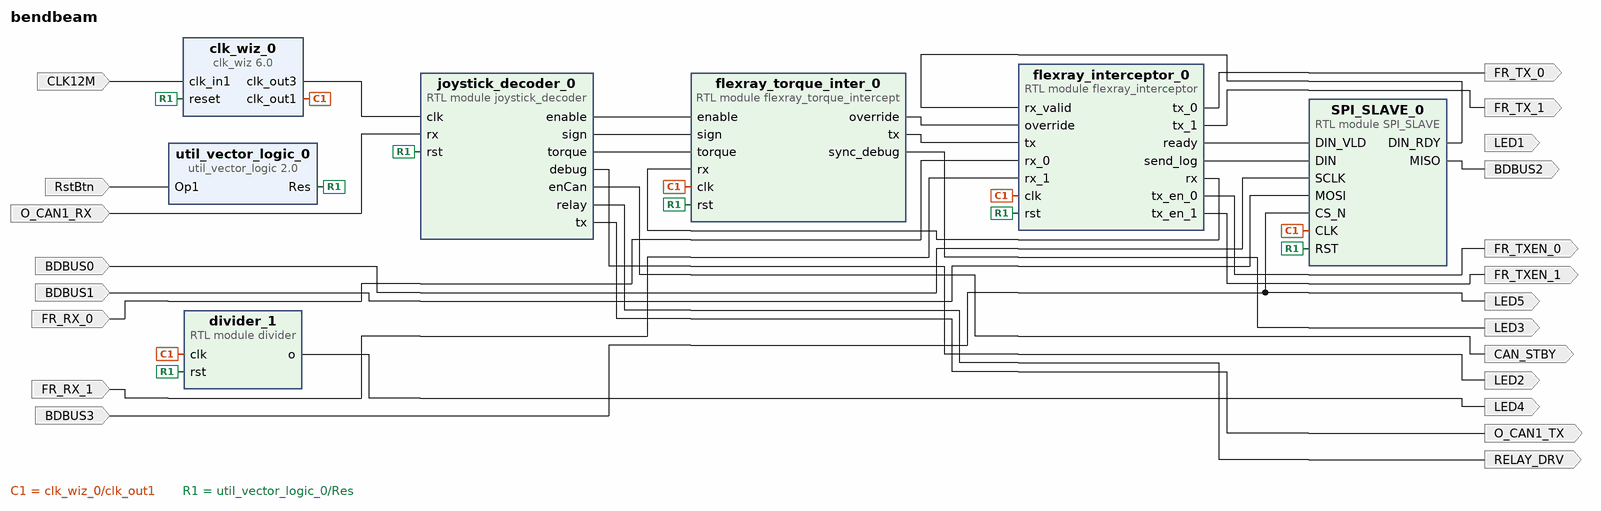
[diagram p0: block diagram of the top level]
# Vivado block design bendbeam, xa7s50csga324-1Q, Vivado 2024.2
create_bd_design bendbeam

create_bd_port -dir I -type clk CLK12M
set_property -dict {CONFIG.FREQ_HZ 12000000} [get_bd_ports CLK12M]
create_bd_port -dir I -type rst RstBtn
create_bd_port -dir I -type data BDBUS3
create_bd_port -dir I -type data FR_RX_0
create_bd_port -dir I -type data FR_RX_1
create_bd_port -dir O -type data RELAY_DRV
create_bd_port -dir O -type data FR_TX_0
create_bd_port -dir O -type data FR_TX_1
create_bd_port -dir O -type data FR_TXEN_0
create_bd_port -dir O -type data FR_TXEN_1
create_bd_port -dir O -type data O_CAN1_TX
create_bd_port -dir I -type data O_CAN1_RX
create_bd_port -dir O -type data CAN_STBY
create_bd_port -dir O LED4
create_bd_port -dir O BDBUS2
create_bd_port -dir I BDBUS1
create_bd_port -dir I BDBUS0
create_bd_port -dir O LED5
create_bd_port -dir O LED3
create_bd_port -dir O LED2
create_bd_port -dir O LED1

create_bd_cell -type ip -vlnv xilinx.com:ip:clk_wiz:6.0 clk_wiz_0
set_property -dict [list \
  CONFIG.CLKIN1_JITTER_PS 833.33 \
  CONFIG.CLKOUT1_JITTER 588.050 \
  CONFIG.CLKOUT1_PHASE_ERROR 613.025 \
  CONFIG.CLKOUT1_REQUESTED_OUT_FREQ 80.000 \
  CONFIG.CLKOUT2_JITTER 686.725 \
  CONFIG.CLKOUT2_PHASE_ERROR 613.025 \
  CONFIG.CLKOUT2_REQUESTED_OUT_FREQ 40.000 \
  CONFIG.CLKOUT2_USED true \
  CONFIG.CLKOUT3_JITTER 959.347 \
  CONFIG.CLKOUT3_PHASE_ERROR 613.025 \
  CONFIG.CLKOUT3_REQUESTED_OUT_FREQ 6.400 \
  CONFIG.CLKOUT3_USED true \
  CONFIG.MMCM_CLKFBOUT_MULT_F 50.000 \
  CONFIG.MMCM_CLKIN1_PERIOD 83.333 \
  CONFIG.MMCM_CLKIN2_PERIOD 10.0 \
  CONFIG.MMCM_CLKOUT0_DIVIDE_F 7.500 \
  CONFIG.MMCM_CLKOUT1_DIVIDE 15 \
  CONFIG.MMCM_CLKOUT2_DIVIDE 94 \
  CONFIG.NUM_OUT_CLKS 3 \
  CONFIG.PRIM_IN_FREQ 12.000 \
] [get_bd_cells clk_wiz_0]
create_bd_cell -type module -reference joystick_decoder joystick_decoder_0
create_bd_cell -type module -reference flexray_interceptor flexray_interceptor_0
create_bd_cell -type module -reference flexray_torque_intercept flexray_torque_inter_0
create_bd_cell -type ip -vlnv xilinx.com:ip:util_vector_logic:2.0 util_vector_logic_0
set_property -dict {CONFIG.C_OPERATION not CONFIG.C_SIZE 1} [get_bd_cells util_vector_logic_0]
create_bd_cell -type module -reference divider divider_1
set_property -dict {CONFIG.divides 80000000} [get_bd_cells divider_1]
create_bd_cell -type module -reference SPI_SLAVE SPI_SLAVE_0

# ---- connections ----

connect_bd_net -net BDBUS0_1 [get_bd_ports BDBUS0] [get_bd_pins SPI_SLAVE_0/SCLK]
connect_bd_net -net BDBUS1_1 [get_bd_ports BDBUS1] [get_bd_pins SPI_SLAVE_0/MOSI]
connect_bd_net -net BDBUS3_1 [get_bd_ports BDBUS3] [get_bd_ports LED5] [get_bd_pins SPI_SLAVE_0/CS_N]
connect_bd_net [get_bd_ports CLK12M] [get_bd_pins clk_wiz_0/clk_in1]
connect_bd_net -net FR_RX_0_1 [get_bd_ports FR_RX_0] [get_bd_pins flexray_interceptor_0/rx_0]
connect_bd_net -net FR_RX_2_1 [get_bd_ports FR_RX_1] [get_bd_pins flexray_interceptor_0/rx_1]
connect_bd_net [get_bd_ports O_CAN1_RX] [get_bd_pins joystick_decoder_0/rx]
connect_bd_net [get_bd_ports RstBtn] [get_bd_pins util_vector_logic_0/Op1]
connect_bd_net [get_bd_pins SPI_SLAVE_0/DIN_RDY] [get_bd_pins flexray_interceptor_0/rx_valid]
connect_bd_net [get_bd_pins SPI_SLAVE_0/MISO] [get_bd_ports BDBUS2]
connect_bd_net [get_bd_pins clk_wiz_0/clk_out1] \
  [get_bd_pins SPI_SLAVE_0/CLK] [get_bd_pins divider_1/clk] [get_bd_pins flexray_interceptor_0/clk] \
  [get_bd_pins flexray_torque_inter_0/clk]
connect_bd_net [get_bd_pins clk_wiz_0/clk_out3] [get_bd_pins joystick_decoder_0/clk]
connect_bd_net [get_bd_pins divider_1/o] [get_bd_ports LED4]
connect_bd_net [get_bd_pins flexray_interceptor_0/ready] [get_bd_pins SPI_SLAVE_0/DIN_VLD]
connect_bd_net [get_bd_pins flexray_interceptor_0/rx] [get_bd_pins flexray_torque_inter_0/rx]
connect_bd_net [get_bd_pins flexray_interceptor_0/send_log] [get_bd_pins SPI_SLAVE_0/DIN]
connect_bd_net [get_bd_pins flexray_interceptor_0/tx_0] [get_bd_ports FR_TX_0]
connect_bd_net [get_bd_pins flexray_interceptor_0/tx_1] [get_bd_ports FR_TX_1]
connect_bd_net [get_bd_pins flexray_interceptor_0/tx_en_0] [get_bd_ports FR_TXEN_0]
connect_bd_net [get_bd_pins flexray_interceptor_0/tx_en_1] [get_bd_ports FR_TXEN_1]
connect_bd_net [get_bd_pins flexray_torque_inter_0/override] [get_bd_pins flexray_interceptor_0/override]
connect_bd_net [get_bd_pins flexray_torque_inter_0/sync_debug] [get_bd_ports LED3]
connect_bd_net [get_bd_pins flexray_torque_inter_0/tx] [get_bd_pins flexray_interceptor_0/tx]
connect_bd_net [get_bd_pins joystick_decoder_0/debug] [get_bd_ports LED2]
connect_bd_net [get_bd_pins joystick_decoder_0/enCan] [get_bd_ports CAN_STBY]
connect_bd_net [get_bd_pins joystick_decoder_0/enable] [get_bd_pins flexray_torque_inter_0/enable]
connect_bd_net [get_bd_pins joystick_decoder_0/relay] [get_bd_ports RELAY_DRV]
connect_bd_net [get_bd_pins joystick_decoder_0/sign] [get_bd_pins flexray_torque_inter_0/sign]
connect_bd_net [get_bd_pins joystick_decoder_0/torque] [get_bd_pins flexray_torque_inter_0/torque]
connect_bd_net [get_bd_pins joystick_decoder_0/tx] [get_bd_ports O_CAN1_TX]
connect_bd_net [get_bd_pins util_vector_logic_0/Res] \
  [get_bd_pins clk_wiz_0/reset] [get_bd_pins SPI_SLAVE_0/RST] [get_bd_pins divider_1/rst] \
  [get_bd_pins flexray_interceptor_0/rst] [get_bd_pins flexray_torque_inter_0/rst] [get_bd_pins joystick_decoder_0/rst]

validate_bd_design
save_bd_design
